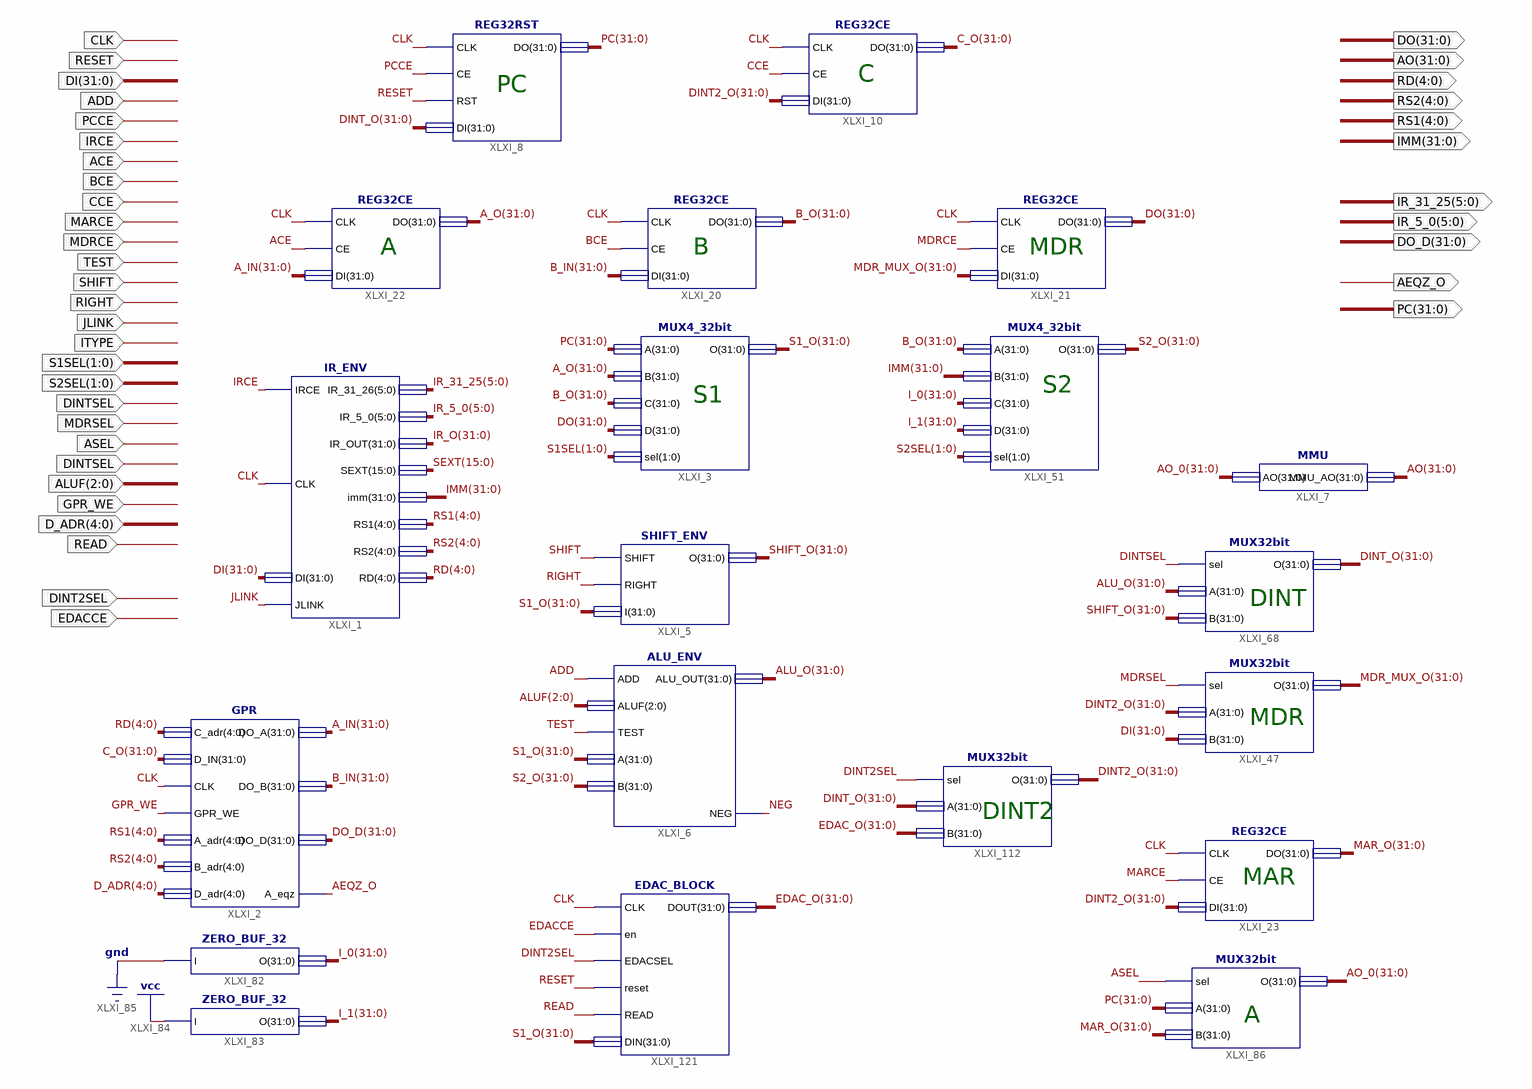
[diagram p0: schematic sheet 1]
// Xilinx ISE schematic DATA_PATH.sch (spartan6) as structural Verilog: 20 symbols, 38 ports
module DATA_PATH (
  input  CLK,
  input  RESET,
  input  [31:0] DI,
  input  ADD,
  input  PCCE,
  input  IRCE,
  input  ACE,
  input  BCE,
  input  CCE,
  input  MARCE,
  input  MDRCE,
  input  TEST,
  input  SHIFT,
  input  RIGHT,
  input  [2:0] ALUF,
  input  GPR_WE,
  input  [4:0] D_ADR,
  input  DINTSEL,
  input  MDRSEL,
  input  JLINK,
  input  ITYPE,
  input  ASEL,
  input  [1:0] S1SEL,
  input  [1:0] S2SEL,
  input  DINT2SEL,
  input  EDACCE,
  input  READ,
  output [31:0] DO_D,
  output [31:0] AO,
  output AEQZ_O,
  output [5:0] IR_31_25,
  output [5:0] IR_5_0,
  output [31:0] PC,
  output [4:0] RD,
  output [4:0] RS1,
  output [4:0] RS2,
  output [31:0] DO,
  output [31:0] IMM
);

  wire NEG;
  wire [15:0] SEXT;
  wire [31:0] A_IN, A_O, ALU_O, AO_0, B_IN, B_O, C_O, DINT2_O, DINT_O, EDAC_O, I_0, I_1, IR_O, MAR_O,
       MDR_MUX_O, S1_O, S2_O, SHIFT_O;

  IR_ENV XLXI_1 (
    .IRCE(IRCE), .CLK(CLK), .JLINK(JLINK), .DI(DI), .IR_31_26(IR_31_25), .IR_5_0(IR_5_0), .IR_OUT(IR_O),
    .SEXT(SEXT), .imm(IMM), .RS1(RS1), .RS2(RS2), .RD(RD));
  REG32CE XLXI_20 (.CLK(CLK), .CE(BCE), .DI(B_IN), .DO(B_O));
  REG32CE XLXI_21 (.CLK(CLK), .CE(MDRCE), .DI(MDR_MUX_O), .DO(DO));
  REG32CE XLXI_22 (.CLK(CLK), .CE(ACE), .DI(A_IN), .DO(A_O));
  GPR XLXI_2 (
    .C_adr(RD), .D_IN(C_O), .CLK(CLK), .GPR_WE(GPR_WE), .A_adr(RS1), .B_adr(RS2), .D_adr(D_ADR), .DO_A(A_IN),
    .DO_B(B_IN), .DO_D(DO_D), .A_eqz(AEQZ_O));
  MMU XLXI_7 (.AO(AO_0), .MMU_AO(AO));
  MUX4_32bit XLXI_51 (.A(B_O), .B(IMM), .C(I_0), .D(I_1), .sel(S2SEL), .O(S2_O));
  MUX4_32bit XLXI_3 (.A(PC), .B(A_O), .C(B_O), .D(DO), .sel(S1SEL), .O(S1_O));
  REG32RST XLXI_8 (.CLK(CLK), .CE(PCCE), .RST(RESET), .DI(DINT_O), .DO(PC));
  REG32CE XLXI_10 (.CLK(CLK), .CE(CCE), .DI(DINT2_O), .DO(C_O));
  REG32CE XLXI_23 (.CLK(CLK), .CE(MARCE), .DI(DINT2_O), .DO(MAR_O));
  MUX32bit XLXI_47 (.sel(MDRSEL), .A(DINT2_O), .B(DI), .O(MDR_MUX_O));
  MUX32bit XLXI_86 (.sel(ASEL), .A(PC), .B(MAR_O), .O(AO_0));
  MUX32bit XLXI_68 (.sel(DINTSEL), .A(ALU_O), .B(SHIFT_O), .O(DINT_O));
  ZERO_BUF_32 XLXI_83 (.I(1'b1), .O(I_1));
  ZERO_BUF_32 XLXI_82 (.I(1'b0), .O(I_0));
  MUX32bit XLXI_112 (.sel(DINT2SEL), .A(DINT_O), .B(EDAC_O), .O(DINT2_O));
  SHIFT_ENV XLXI_5 (.SHIFT(SHIFT), .RIGHT(RIGHT), .I(S1_O), .O(SHIFT_O));
  ALU_ENV XLXI_6 (.ADD(ADD), .ALUF(ALUF), .TEST(TEST), .A(S1_O), .B(S2_O), .ALU_OUT(ALU_O), .NEG(NEG));
  EDAC_BLOCK XLXI_121 (
    .CLK(CLK), .en(EDACCE), .EDACSEL(DINT2SEL), .reset(RESET), .READ(READ), .DIN(S1_O), .DOUT(EDAC_O));

  // Notes on the sheet:
  //   C
  //   PC
  //   A
  //   B
  //   MDR
  //   S2
  //   S1
  //   DINT
  //   MDR
  //   DINT2
  //   MAR
  //   A
endmodule
